# EAGLE design HalfA (EAGLE 9.5.1)
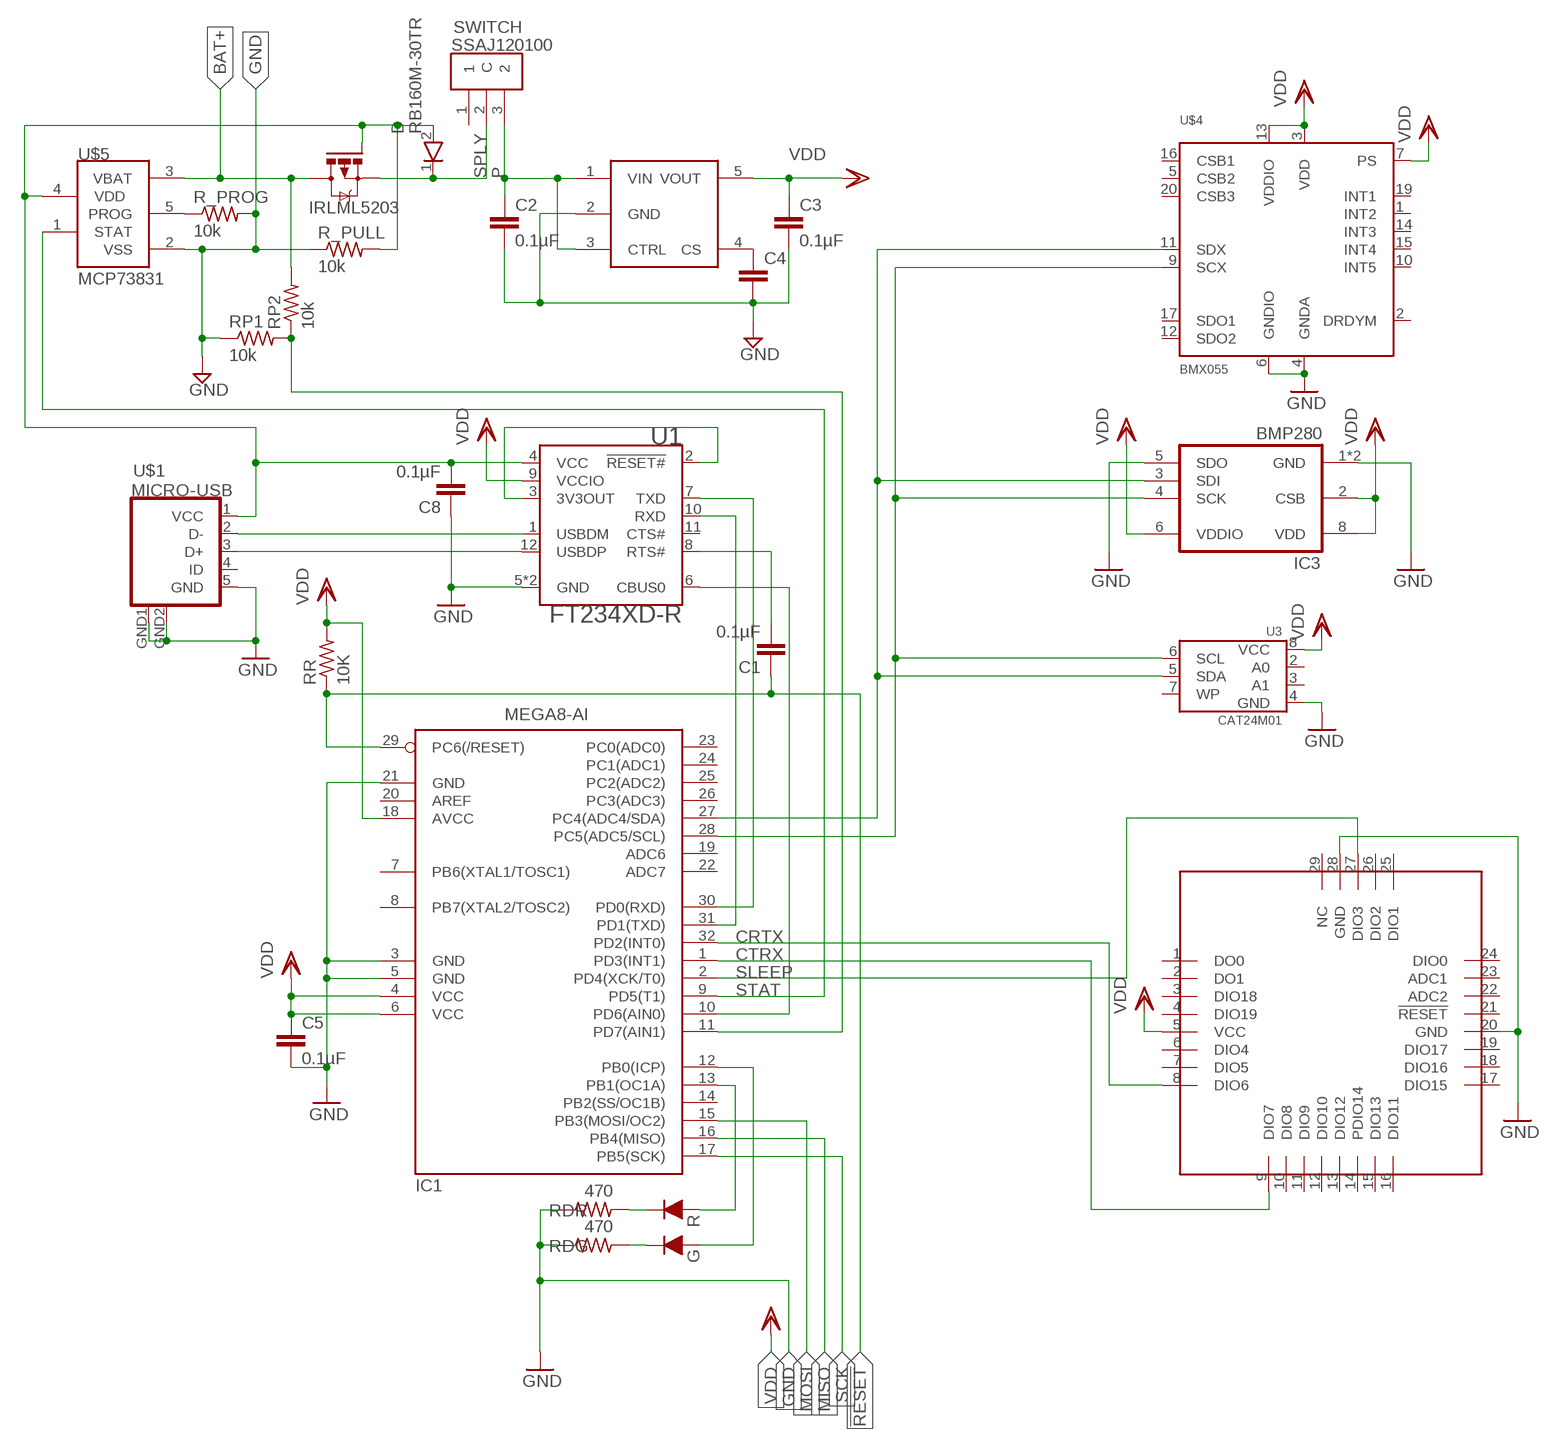
[diagram p0: schematic, sheet 1]

## Parts
C1  0.1µF  C-EUC0402K  [C0402K]
C2  0.1µF  C-EUC0402K  [C0402K]
C3  0.1µF  C-EUC0402K  [C0402K]
C4  C-EUC0402K  [C0402K]
C5  0.1µF  C-EUC0402K  [C0402K]
C8  0.1µF  C-EUC0402K  [C0402K]
D  RB160M-30TR  [SODFL3516X90N]
IC1  MEGA8-AI  [TQFP32-08]
IC3  BMP280  [BMP280]
Q1  IRLML5203  [MICRO3]
R_PROG  10k  R-US_R0402  [R0402]
R_PULL  10k  R-US_R0402  [R0402]
RDG  470  R-US_R0402  [R0402]
RDR  470  R-US_R0402  [R0402]
RP1  10k  R-US_R0402  [R0402]
RP2  10k  R-US_R0402  [R0402]
RR  10K  R-US_R0402  [R0402]
SWITCH  SSAJ120100  [SSAJ120100]
U1  FT234XD-R  [SON45P300X300X80-13N]
U3  CAT24M01  [SO-8]
U$1  MICRO-USB  [MICRO-USB]
U$2  NJM12888F  [NJM12888F]
U$3  LITE  [LITE]
U$4  BMX055  [BMX055]
U$5  MCP73831  [SOT23-5L]
U$6  SML-P24MUW  [SML-P24MUW]

## Nets
3.3V: U1.2(!RESET#) U1.3(3V3OUT)
5V: C8.2 D.2(A) Q1.1(G) R_PULL.2 U1.4(VCC) U$1.1(VCC) U$5.4(VDD)
!RESET!: C1.1 IC1.29(PC6(/RESET)) RR.1
!RTS!: C1.2 U1.8(RTS#)
BAT: IC1.11(PD7(AIN1)) RP1.2 RP2.1
BAT+: Q1.3(D) RP2.2 U$5.3(VBAT)
CRTX: IC1.32(PD2(INT0)) U$3.8(DIO6)
CS: C4.1 U$2.4(CS)
CTRX: IC1.1(PD3(INT1)) U$3.9(DIO7)
D+: U1.12(USBDP) U$1.3(D+)
D-: U1.1(USBDM) U$1.2(D-)
GND: C2.2 C3.2 C4.2 C5.2 C8.1 IC1.3(GND) IC1.5(GND) IC1.21(GND) IC3.1(GND) IC3.5(SDO) IC3.7(GND) R_PROG.2 R_PULL.1 RDG.1 RDR.1 RP1.1 U1.5(GND) U1.13(GND) U3.4(GND) U$1.5(GND) U$1.GND1(GND) U$1.GND2(GND) U$2.2(GND) U$3.20(GND) U$3.28(GND) U$4.4(GNDA) U$4.6(GNDIO) U$5.2(VSS)
LED: IC1.13(PB1(OC1A)) U$6.2(RA)
LEDG: IC1.12(PB0(ICP)) U$6.1(GA)
MISO: IC1.16(PB4(MISO))
MOSI: IC1.15(PB3(MOSI/OC2))
N$2: RDR.2 U$6.3(RC)
N$4: RDG.2 U$6.4(GC)
N$9: R_PROG.1 U$5.5(PROG)
P: C2.1 SWITCH.3 U$2.1(VIN) U$2.3(CTRL)
SCK: IC1.17(PB5(SCK))
SCL: IC1.28(PC5(ADC5/SCL)) IC3.4(SCK) U3.6(SCL) U$4.9(SCX)
SDA: IC1.27(PC4(ADC4/SDA)) IC3.3(SDI) U3.5(SDA) U$4.11(SDX)
SLEEP: IC1.2(PD4(XCK/T0)) U$3.27(DIO3)
SPLY: D.1(K) Q1.2(S) SWITCH.2(C)
STAT: IC1.9(PD5(T1)) U$5.1(STAT)
TX/RX: IC1.10(PD6(AIN0)) U1.6(CBUS0)
URTX: IC1.30(PD0(RXD)) U1.7(TXD)
UTRX: IC1.31(PD1(TXD)) U1.10(RXD)
VDD: C3.1 C5.1 IC1.4(VCC) IC1.6(VCC) IC1.18(AVCC) IC3.2(CSB) IC3.6(VDDIO) IC3.8(VDD) RR.2 U1.9(VCCIO) U3.8(VCC) U$2.5(VOUT) U$3.5(VCC) U$4.3(VDD) U$4.7(PS) U$4.13(VDDIO)
Unconnected: IC1.7(PB6(XTAL1/TOSC1)) IC1.8(PB7(XTAL2/TOSC2)) IC1.14(PB2(SS/OC1B)) IC1.19(ADC6) IC1.20(AREF) IC1.22(ADC7) IC1.23(PC0(ADC0)) IC1.24(PC1(ADC1)) IC1.25(PC2(ADC2)) IC1.26(PC3(ADC3)) SWITCH.1 U1.11(CTS#) U3.2(A0) U3.3(A1) U3.7(WP) U$1.4(ID) U$3.1(DO0) U$3.2(DO1) U$3.3(DIO18) U$3.4(DIO19) U$3.6(DIO4) U$3.7(DIO5) U$3.10(DIO8) U$3.11(DIO9) U$3.12(DIO10) U$3.13(DIO12) U$3.14(PDIO14) U$3.15(DIO13) U$3.16(DIO11) U$3.17(DIO15) U$3.18(DIO16) U$3.19(DIO17) U$3.21(!RESET!) U$3.22(ADC2) U$3.23(ADC1) U$3.24(DIO0) U$3.25(DIO1) U$3.26(DIO2) U$3.29(NC) U$4.1(INT2) U$4.2(DRDYM) U$4.5(CSB2) U$4.10(INT5) U$4.12(SDO2) U$4.14(INT3) U$4.15(INT4) U$4.16(CSB1) U$4.17(SDO1) U$4.19(INT1) U$4.20(CSB3)

## Library data of the parts
C1-C5 C8 = rcl:C-EU: CAPACITOR, European symbol; SPICEPREFIX: C
D = RB160M-30TR:RB160M-30TR: ROHM - RB160M-30TR - DIODE, SCHOTTKY, PMDS Source: Datasheet <https://componentsearchengine.com/Datasheets/2/RB160M-30TR.pdf>; DESCRIPTION: ROHM - RB160M-30TR - DIODE, SCHOTTKY, PMDS; HEIGHT: 0.9mm; MANUFACTURER_NAME: ROHM Semiconductor; MANUFACTURER_PART_NUMBER: RB160M-30TR; MOUSER_PART_NUMBER: 755-RB160M-30TR; MOUSER_PRICE-STOCK: https://www.mouser.com/Search/Refine.aspx?Keyword=755-RB160M-30TR; RS_PART_NUMBER: 7526079; RS_PRICE-STOCK: https://uk.rs-online.com/web/p/products/7526079
IC1 = atmel:MEGA8: MICROCONTROLLER 8 Kbytes FLASH, 1 kbytes SRAM, 512 bytes EEPROM, USART, 6-channel 10 bit ADC, 2-channel 8 bit ADC Pin compatible with Atmega48, ATMega88, ATMega168 Source: avr.lbr; MPN: ATMEGA8-16AU; OC_FARNELL: 9171371; OC_NEWARK: 73M8863
IC3 = bosch-bmp280:BMP280: The BMP280 is an absolute barometric pressure sensor especially designed for mobile applications. The sensor module is housed in an extremely compact 8-pin metal-lid LGA package with a footprint of only 2.0 × 2.5 mm2 and 0.95 mm package height. Its small dimensions and its low power consumption of 2.7 μA @1Hz allow the implementation in battery driven devices such as mobile phones, GPS modules or watches. The library has been designed by Richard Magdycz <https://www.facebook.com/groups/eaglecadsoftUK>
Q1 = transistor-power:IRLML5203: HEXFET P-Channel Power MOSFET
R_PROG R_PULL RDG RDR RP1 RP2 RR = rcl:R-US_: RESISTOR, American symbol; SPICEPREFIX: R
SWITCH = SSAJ120100:SSAJ120100: Slide Switches 1-pole 2-positions Surface Mount Slide Switch SPDT Maintained 10 mA Slide Source: Datasheet <http://www.farnell.com/datasheets/1582290.pdf>; DESCRIPTION: Slide Switches 1-pole 2-positions Surface Mount Slide Switch SPDT Maintained 10 mA Slide; HEIGHT: mm; MANUFACTURER_NAME: ALPS; MANUFACTURER_PART_NUMBER: SSAJ120100; MOUSER_PART_NUMBER: 688-SSAJ120100; MOUSER_PRICE-STOCK: https://www.mouser.com/Search/Refine.aspx?Keyword=688-SSAJ120100; RS_PART_NUMBER: 1238892; RS_PRICE-STOCK: http://uk.rs-online.com/web/p/products/1238892
U1 = FT234XD-R:FT234XD-R: USB Full Speed to Basic UART IC with USB Charger Detection; DESCRIPTION: USB Full Speed to Basic UART IC with USB Charger Detection; DIGI-KEY_PART_NUMBER: 768-1178-1-ND; DIGI-KEY_PURCHASE_URL: https://www.digikey.jp/product-detail/en/ftdi-future-technology-devices-international-ltd/FT234XD-R/768-1178-1-ND/3904926?utm_source=snapeda&utm_medium=aggregator&utm_campaign=symbol; MF: FTDI,; MP: FT234XD-R; PACKAGE: DFN-12 FTDI
U3 = CAT24M01:CAT24M01: 1Mb I2C CMOS EEPROM; AVAILABILITY: Unavailable; DESCRIPTION: ON Semiconductor 1MB I2C SERIAL EEPROM; MF: ON Semiconductor; MP: CAT24M01; PACKAGE: SOIC-8 ON Semiconductor; PRICE: None
U$1 = microusb2:MICRO-USB: Micro USB B connector
U$2 = mylib:NJM12888F
U$3 = TWELite:LITE
U$4 = BMX055:BMX055: BMX055 Small, versatile 9 - axis sensor module; DIGI-KEY_PART_NUMBER: 828-1060-1-ND; DIGI-KEY_PURCHASE_URL: https://www.digikey.jp/product-detail/en/bosch-sensortec/BMX055/828-1060-1-ND/6136311?utm_source=snapeda&utm_medium=aggregator&utm_campaign=symbol; MF: Bosch Sensortec; MP: BMX055; PACKAGE: LGA-20 Bosch
U$5 = mcp73831:MCP73831: Miniature Single-Cell, Fully Integrated Li-Ion, Li-Polymer Charge Management Controllers
U$6 = mylib:SML-P24MUW

## Board
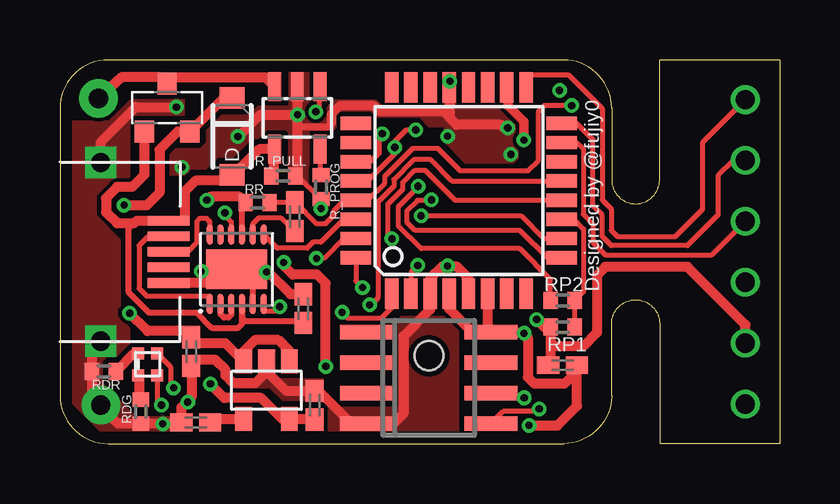
[diagram p1: board, top side]
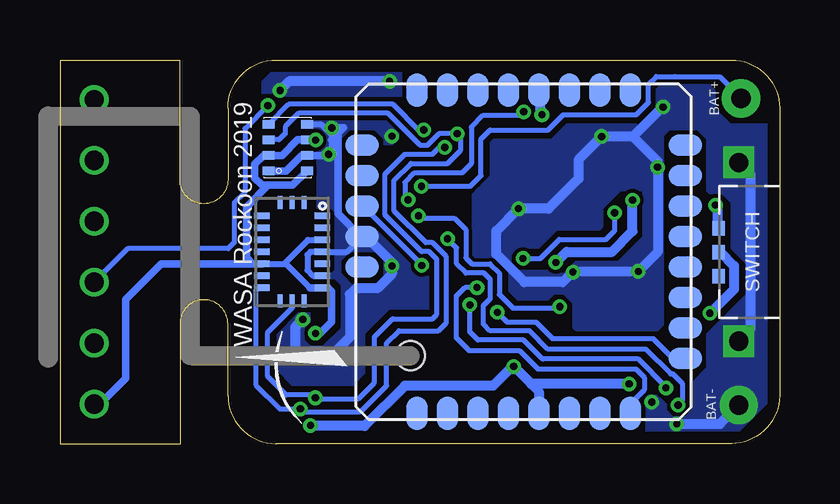
[diagram p2: board, bottom side, seen from below]

Size 30 x 16 mm. Coordinates in mm from the lower left corner, seen from the top.
Outline: 2,0 21,0 arc90 23,2 23,5 arc-180 25,5 25,0 30,0 30,16 25,16 25,11 arc-180 23,11 23,14 arc90 21,16 2,16 arc90 0,14 0,2 arc90 2,0
Copper layers (1*16): Top 0.035mm / dielectric 1.5mm / Bottom 0.035mm
Design rules "SeeedStudio_2layer_DRU_no_angle_20140221 *": minimum track width 6mil, minimum drill 0.3mm, track to track 6mil, track to pad 6mil, pad to pad 6mil, via to via 6mil, smd to smd 0mil, copper to edge 10mil, drill to drill 10mil, minimum pad ring 10mil, minimum via ring 6mil, stop-mask expansion 2mil, vias tented up to drill 100mil, thermal gap 10mil

### Footprints (pad centres in the part's own frame; a part is rotated, then mirrored left to right if it is on the bottom)
C0402K = smd 0.925 x 0.74: 1 -0.6,0; 2 0.6,0
SODFL3516X90N = smd 0.9 x 1.04: 1 -1.6,0; 2 1.6,0
TQFP32-08 = smd 1.27 x 0.559: 1 -4.293,2.8; 2 -4.293,2; 3 -4.293,1.2; 4 -4.293,0.4; 5 -4.293,-0.4; 6 -4.293,-1.2; 7 -4.293,-2; 8 -4.293,-2.8; 17 4.293,-2.8; 18 4.293,-2; 19 4.293,-1.2; 20 4.293,-0.4; 21 4.293,0.4; 22 4.293,1.2; 23 4.293,2; 24 4.293,2.8 | smd 0.559 x 1.27: 9 -2.8,-4.293; 10 -2,-4.293; 11 -1.2,-4.293; 12 -0.4,-4.293; 13 0.4,-4.293; 14 1.2,-4.293; 15 2,-4.293; 16 2.8,-4.293; 25 2.8,4.293; 26 2,4.293; 27 1.2,4.293; 28 0.4,4.293; 29 -0.4,4.293; 30 -1.2,4.293; 31 -2,4.293; 32 -2.8,4.293
BMP280 = smd 0.35 x 0.5: 1 0.975,-0.8; 2 0.325,-0.8; 3 -0.325,-0.8; 4 -0.975,-0.8; 5 -0.975,0.8; 6 -0.325,0.8; 7 0.325,0.8; 8 0.975,0.8
MICRO3 = smd 0.8 x 0.9: 1 -0.95,-1; 2 0.95,-1; 3 0,1
R0402 = smd 0.6 x 0.7: 1 -0.5,0; 2 0.5,0
SSAJ120100 = smd 0.6 x 0.51: 1 0,0; 2 2,0; 3 1,0
SON45P300X300X80-13N = smd 0.85 x 0.25: 1 -1.45,1.125; 2 -1.45,0.675; 3 -1.45,0.225; 4 -1.45,-0.225; 5 -1.45,-0.675; 6 -1.45,-1.125; 7 1.45,-1.125; 8 1.45,-0.675; 9 1.45,-0.225; 10 1.45,0.225; 11 1.45,0.675; 12 1.45,1.125 | smd 1.65 x 2.55: 13 0,0
SO-8 = smd 2.2 x 0.6: 1 -2.6,1.905; 2 -2.6,0.635; 3 -2.6,-0.635; 4 -2.6,-1.905; 5 2.6,-1.905; 6 2.6,-0.635; 7 2.6,0.635; 8 2.6,1.905
MICRO-USB = smd 0.4 x 1.75: 1 -1.3,4.525; 2 -0.65,4.525; 3 0,4.525; 4 0.65,4.525; 5 1.3,4.525 | drill 0.8 pad 1.27 square: GND1 -3.725,1.7; GND2 3.725,1.7
NJM12888F = smd 0.7 x 1: 1 -0.95,-1.2; 2 0,-1.2; 3 0.95,-1.2; 4 0.95,1.2; 5 -0.95,1.2
LITE = smd 1.4 x 0.9: 1 0.25,11.43; 2 0.25,10.16; 3 0.25,8.89; 4 0.25,7.62; 5 0.25,6.35; 6 0.25,5.08; 7 0.25,3.81; 8 0.25,2.54; 17 13.72,2.54; 18 13.72,3.81; 19 13.72,5.08; 20 13.72,6.35; 21 13.72,7.62; 22 13.72,8.89; 23 13.72,10.16; 24 13.72,11.43 | smd 0.9 x 1.4: 9 2.54,0.25; 10 3.81,0.25; 11 5.08,0.25; 12 6.35,0.25; 13 7.62,0.25; 14 8.89,0.25; 15 10.16,0.25; 16 11.43,0.25; 25 11.43,13.72; 26 10.16,13.72; 27 8.89,13.72; 28 7.62,13.72; 29 6.35,13.72 | hole 1.2: 2.65,11.7
BMX055 = smd 0.675 x 0.25: 1 1.262,1.5; 2 1.262,1; 3 1.262,0.5; 4 1.262,0; 5 1.262,-0.5; 6 1.262,-1; 7 1.262,-1.5; 11 -1.262,-1.5; 12 -1.262,-1; 13 -1.262,-0.5; 14 -1.262,0; 15 -1.262,0.5; 16 -1.262,1; 17 -1.262,1.5 | smd 0.25 x 0.55: 8 0.5,-2.05; 9 0,-2.05; 10 -0.5,-2.05; 18 -0.5,2.05; 19 0,2.05; 20 0.5,2.05
SOT23-5L = smd 0.533 x 1.2: 1 -0.95,-1.3; 2 0,-1.3; 3 0.95,-1.3 | smd 0.55 x 1.2: 4 0.95,1.3; 5 -0.95,1.3
SML-P24MUW = smd 0.5 x 0.5: 1 -0.45,-0.4; 2 0.45,-0.4; 3 0.45,0.4; 4 -0.45,0.4

### Placement (x,y rotation side)
C1  9.79,9.46 270 top
C2  5.47,3.84 270 top
C3  10.62,1.6 90 top
C4  5.67,0.88 180 top
C5  20.95,3.27 180 top
C8  10.15,5.63 270 top
D  7.17,12.81 270 top
IC1  16.63,10.55 90 top
IC3  20.5,12.34 270 bottom
Q1  4.47,14.01 0 top
R_PROG  10.88,10.7 270 top
R_PULL  9.3,11.16 180 top
RDG  3.37,1.34 90 top
RDR  1.83,3.01 0 top
RP1  20.95,4.86 0 top
RP2  20.95,5.97 180 top
RR  8.24,10.05 180 top
SWITCH  2.54,6.98 90 bottom
U1  7.37,7.27 90 top
U3  15.37,2.74 0 top
U$1  0,8 270 top
U$2  8.61,2.23 180 top
U$3  3.68,1.01 90 bottom
U$4  20.32,8 0 bottom
U$5  9.9,13.58 180 top
U$6  3.65,3.3 90 top

### Tracks (layer width: path | path; a pad name or v marks a point on that pad's centre or on a via)
3.3V
  Top 0.254: U1.3 7.14,5.38 7.02,5.26 6.84,5.26 6.69,5.4 U1.2
5V
  Top 0.254: 3.09,9.19 2.87,8.96 2.87,6.3 3.71,5.46 5.69,5.46 6.33,4.83 7.43,4.83 7.59,4.99 U1.4 7.59,5.23 7.73,5.1 10.08,5.1 C8.2
  Top 0.406: R_PULL.2 8.9,11.25 8.9,12.23 U$5.4 8.31,12.28 7.25,11.21 D.2 6.92,10.97 5.65,10.97 5.19,10.51 5.19,9.3 U$1.1 3.21,9.3 3.09,9.19 2.38,9.19 1.92,9.64 1.92,10.24 2.38,10.7 3.02,10.7 3.52,11.2 Q1.1
!RESET!  (via drill 0.3, 0.8)
  Top 0.2: v21.34,14.1 20.19,14.1 19.94,13.84 19.94,11.81 19.51,11.38 16.68,11.38 15.75,12.32 14.71,12.32 13.54,11.15 13.54,10.87 12.83,10.15 IC1.29 11.87,10.15 11.43,9.72 11.43,9.53 11.08,9.17 10.69,9.17 C1.1 9.78,10.05 RR.1
  Bottom 0.2: v21.34,14.1 22.29,13.14 22.29,10.47 22.73,10.03 22.73,8.38 22.99,8.13 27.18,8.13 v28.57,6.73
!RTS!
  Top 0.2: U1.8 8.04,9.16 8.3,9.42 9.19,9.42 9.74,8.87 C1.2
BAT
  Top 0.2: IC1.11 20.95,9.38 21.4,9.38 21.83,8.95 21.83,6.34 RP2.1 RP1.2
BAT+  (via drill 0.3, 0.8 pad 1.6)
  Top 0.2: RP2.2 20.45,6.85 19.18,8.13 15.06,8.13 14.1,9.08 14.1,9.87 14.93,10.7 v14.93,10.73
  Top 0.406: v1.6,14.4 2.56,15.28 4.2,15.28 Q1.3 4.73,15.27 8.56,15.27 U$5.3
  Bottom 0.2: v1.6,14.4 2.49,15.29 4.38,15.3 5.14,15.3 5.46,14.98 5.46,14.22 5.97,13.71 9.02,13.71 9.65,13.08 12.06,13.08 12.45,12.7 12.45,11.18 12.89,10.73 v14.93,10.73
CRTX  (via drill 0.3)
  Top 0.2: IC1.32 12.34,6.79 v12.62,6.51
  Bottom 0.2: v12.62,6.51 13.11,6.51 13.48,6.14 13.48,4.42 12.94,3.88 10.85,3.88 10.08,3.11 5.99,3.11 5.64,2.76 5.64,2.23 6.22,1.65 U$3.8
CS
  Top 0.406: C4.1 6.41,1.03 U$2.4
CTRX  (via drill 0.3)
  Top 0.2: v11.76,5.47 12.02,5.22 13.39,5.22 13.83,5.66 IC1.1
  Bottom 0.2: U$3.9 4.44,3.56 5.26,4.37 9.46,4.37 10.15,5.07 11.36,5.07 v11.76,5.47
D+
  Top 0.2: U$1.3 5.33,8 5.71,8.38 5.71,9.27 5.84,9.4 6.1,9.4 6.24,9.25 U1.12
D-
  Top 0.2: U$1.2 4.51,8.63 3.68,8.63 3.3,8.25 3.3,6.48 3.64,6.14 6.18,6.14 6.24,6.07 U1.1
GND  (via drill 0.3, 0.8, 0.8 pad 1.6)
  Top 0.2: R_PROG.2 10.86,10.2 9.89,11.16 R_PULL.1
  Top 0.254: U1.5 8.03,5.83 8.03,6.61 U1.13
  Top 0.3: 11.32,13.38 11.14,13.21 9.91,13.21
  Top 0.4: 16.24,13.59 15.99,13.84 13.34,13.84 13.08,14.1 11.67,14.1 11.32,13.74 11.32,13.38
  Top 0.406: v18.66,13.17 18.5,13.17 18.37,13.3 16.53,13.3 16.24,13.59 IC1.21 16.23,15.09 v16.26,15.11 | v7.42,12.8 7.44,12.8 8.35,13.71 v9.91,13.71 | U$1.GND2 1.33,3.91 RDR.1 1.33,1.92 v1.7,1.6 2.33,0.92 2.42,0.83 RDG.1 5.02,0.83 C4.2 5.07,1.51 5.48,1.93 5.48,3.23 C2.2 5.72,3.49 6.5,3.49 6.9,3.09 6.9,2.83 7.22,2.51 8.13,2.51 8.61,3 U$2.2 8.61,3.02 9.43,2.2 C3.2 10.77,2.2 12.14,0.83 U3.4 12.85,0.76 13.84,0.76 14.32,1.24 14.32,4.47 15.43,5.58 IC1.3 15.43,6.9 15.91,7.38 16.13,7.38 v16.16,7.41 16.18,7.38 16.56,7.38 17.03,6.91 IC1.5 | U$1.5 6.8,6.7 U1.13 8.33,7.27 8.44,7.15 v8.61,7.15 8.69,7.15 9.61,6.23 C8.1 | 20.45,4.06 RP1.1 20.19,4.86 v19.87,5.17 | 20.45,4.06 20.45,3.37 C5.2 | U$5.2 9.91,14.86 v9.91,13.71 | R_PULL.1 9.91,11.26 9.91,13.21 v9.91,13.71 | 20.45,4.06 21.82,4.06 22.39,4.63 22.39,7.02 22.73,7.37 26.16,7.37 28.57,4.95 v28.57,4.19 | U$1.GND1 1.7,12.57 3.17,14.03 v4.86,14.03 | R_PROG.2 v10.88,9.8
  Bottom 0.254: U$3.28 18.04,8 U$4.4 19.56,8 19.68,7.87 19.68,7.24 19.45,7 U$4.6 | IC3.5 19.12,13.32 18.68,12.88 18.68,12.66 18.68,12.15
  Bottom 0.305: 18.68,12.15 18.81,12.02 IC3.7 19.92,12.02 20.57,11.37 IC3.1 | 18.68,12.66 18.17,13.17 v18.66,13.17 18.41,12.92 18.41,9.58 17.47,8.63 U$3.28
  Bottom 0.4: v5.89,7.18 8.58,7.18 v8.61,7.15
  Bottom 0.406: U$1.GND1 1.23,11.25 1.23,4.75 U$1.GND2 | U$3.28 17.24,8.63 16.16,7.55 v16.16,7.41 16.16,7.08 16.76,6.48 17.65,6.48 17.91,6.22 17.91,4.44 18.67,3.68 19.94,3.68 20.19,3.94 20.19,4.85 v19.87,5.17 | U$3.20 10.09,14.73 9.97,14.61 9.97,13.71 v9.91,13.71 | 6.12,12.8 v7.42,12.8 8.38,11.84 8.38,11.05 9.63,9.8 v10.88,9.8 11.81,8.87 11.81,7.9 10.64,6.73 9.03,6.73 v8.61,7.15 | 6.12,12.8 5.08,11.77 v5.08,11.53 5.08,7.99 v5.89,7.18 | v4.86,14.03 4.89,14.03 6.12,12.8 | v4.28,0.82 2.48,0.82 v1.7,1.6 | v16.26,15.11 20.45,15.11 v20.83,14.73
  other vias: 5.32,1.73 16.16,12.82 18.8,12.06
  pour Top: 16,5.33 14.22,5.33 14.1,5.21 14.1,0.51 16.64,0.51 16.64,4.7
  pour Top (no thermals): 0.51,13.46 2.92,13.46 2.92,11.05 2.29,11.05 2.03,10.79 0.51,10.79
  pour Top (no thermals): 11.18,1.65 11.18,0.51 14.22,0.51 14.22,1.4 14.1,1.52 11.68,1.52 11.56,1.65
  pour Top (no thermals): 10.67,1.78 9.27,1.78 8.75,2.3 7.34,2.3 7.34,2.64 7.43,2.73 10.98,2.73 10.98,2.09
  pour Top (no thermals): 5.46,0.51 1.65,0.51 0.51,1.65 0.51,11.43 0.64,11.3 2.29,11.3 1.98,11 1.98,10.8 1.52,10.34 1.52,9.52 1.52,5.71 1.78,5.46 1.78,2.54 1.91,2.41 3.17,1.14 5.08,1.14 5.46,0.76
  pour Top (no thermals): 1.78,3.43 1.97,3.62 2.36,3.62 2.92,4.18 2.92,4.44 2.92,4.83 2.41,5.33 2.41,5.59 2.54,5.71 2.54,8.25 2.54,8.51 1.52,9.52 1.52,3.68
  pour Top (no thermals): 2.93,13.22 2.93,13.6 3,13.67 5.21,13.67 5.21,14.38 2.95,14.38 1.91,13.33 1.91,13.08 2.03,13.21 2.92,13.21
  pour Top (no thermals): 10.41,10.67 10.41,15.49 9.53,15.49 9.53,14.1 8.26,14.1 7.87,13.71 7.37,13.71 6.73,13.71 6.1,13.08 6.1,12.83 6.1,12.57 5.84,12.32 4.83,12.32 4.57,12.06 4.57,11.18 5.21,11.18 5.46,11.43 6.1,11.43 6.6,11.94 6.73,11.94 7.24,11.94 8,12.7 8.26,12.7 8.64,13.08 9.4,13.08 9.51,12.96 9.51,11.28 9.8,11.28
  pour Top (no thermals): 16,14.48 16,12.57 16.89,11.68 18.9,11.68 19.11,11.9 19.11,13.97 16.51,13.97 16.51,14.6 16.38,14.48
  pour Bottom (no thermals): 19.56,5.46 20.07,5.46 20.95,4.57 20.95,3.05 20.32,2.41 17.78,2.41 17.27,2.92 17.27,4.57 16.26,5.59 14.61,5.59 14.61,6.98 15.11,6.98 15.37,7.24 15.37,7.49 16.89,9.02 17.78,9.02 18.03,8.76 18.03,7.87 17.91,8 16.51,8 16.51,6.98 16.89,6.6 18.29,6.6 18.29,4.83 19.05,4.06 19.56,4.06 19.81,4.32 19.81,4.83 19.56,5.08
  pour Bottom (no thermals): 10.16,10.67 12.57,10.67 12.83,10.41 12.83,7.87 12.7,7.75 11.56,7.75 11.3,7.49 11.18,7.49 11.18,7.87 10.92,8.13 10.03,8.13 9.27,8.89 7.49,8.89 7.37,9.02 7.37,9.78 5.33,11.81 5.33,12.7 5.97,13.33 8.89,13.33 9.4,12.83 9.4,11.43
  pour Bottom (no thermals): 11.3,7.24 11.3,6.35 10.92,5.97 9.65,5.97 9.53,6.09 9.4,6.22 9.02,6.22 8.64,5.84 8.64,4.83 8.51,4.7 5.08,4.7 4.95,4.83 4.83,4.95 4.83,11.81 5.59,11.81 5.71,11.68 5.71,8.63 6.73,7.62 8.51,7.62 8.89,7.24 9.02,7.11 9.53,7.11 9.65,7.24
  pour Bottom (no thermals): 5.16,13.76 5.16,14.78 4.95,14.98 2.92,14.98 2.67,14.73 2.67,13.97 2.03,13.33 0.51,13.33 0.51,11.05 2.92,11.05 3.05,11.18 3.05,12.7 3.43,13.08 4.57,13.08 4.83,12.83 4.83,10.67 4.95,10.54 6.86,10.54 6.86,12.06
  pour Bottom (no thermals): 5.59,0.51 1.65,0.51 0.51,1.65 0.51,11.3 3.05,11.3 3.05,10.54 2.92,10.41 2.41,10.41 2.03,10.03 2.03,8.13 1.4,7.49 1.4,6.22 3.05,4.57 3.05,3.17 3.68,2.54 3.68,1.4 3.94,1.14 4.45,1.14 4.7,1.4 4.7,1.65 5.08,2.03 5.59,2.03
  pour Bottom (no thermals): 9.53,12.7 11.94,12.7 12.06,12.57 12.06,11.18 12.83,10.41 12.83,9.52 9.14,9.52 9.14,13.08
  pour Bottom (no thermals): 15.75,15.49 21.21,15.49 21.59,15.11 21.59,14.6 21.08,14.6 20.95,14.48 15.75,14.48
  pour Bottom (no thermals): 19.94,13.46 16.38,13.46 15.88,12.95 15.88,12.7 16.13,12.45 16.51,12.45 16.51,12.7 16.89,13.08 17.91,13.08 18.29,12.7 18.29,9.78 18.54,9.52 18.54,9.65 18.67,9.78 19.3,9.78 19.3,12.95 19.56,13.21 19.68,13.21
  pour Bottom (no thermals): 18.54,9.65 18.54,7.24 18.67,7.11 18.8,7.11 18.8,6.86 18.54,6.86 18.03,6.35 17.53,6.35 17.53,6.48 17.65,6.6 17.78,6.6 18.29,7.11 18.29,7.49 18.29,7.62 17.91,8 17.91,9.02
  pour Top (no thermals): 10.41,13.46 10.92,13.46 11.11,13.65 11.11,14.03 11.43,14.35 13.21,14.35 13.59,13.97 16.13,13.97 16.13,13.21 15.37,13.21 14.99,13.59 13.21,13.59 12.95,13.84 11.68,13.84 11.56,13.71 11.56,13.21 11.4,13.05 10.34,13.05 10.34,13.39
LED  (via drill 0.3)
  Top 0.2: U$6.2 4.61,3.19 4.61,2.45 v4.74,2.32 | v12.91,5.78 12.96,5.78 13.26,6.08 13.26,10.07 13.92,10.73 13.92,11.02 14.75,11.84 15.46,11.84 16.35,10.95 IC1.13
  Bottom 0.2: v4.74,2.32 4.74,2.37 5.89,3.53 9.88,3.53 10.67,4.32 12.57,4.32 12.91,4.66 v12.91,5.78
LEDG  (via drill 0.3)
  Top 0.2: U$6.1 4.05,1.78 v4.23,1.6 | IC1.12 16.48,10.15 15.23,11.4 14.81,11.4 14.3,10.89 14.3,10.61 13.67,9.98 13.67,8.7 v13.83,8.54 v13.84,8.54
  Bottom 0.2: v4.23,1.6 4.03,1.8 4.03,2.49 4.44,2.9 4.54,2.9 5.58,3.94 9.65,3.94 10.41,4.7 12.06,4.7 12.35,4.98 12.35,5.76 12.06,6.05 12.06,6.85 12.32,7.11 13.08,7.11 13.46,7.49 13.46,8.16 v13.84,8.54
MISO  (via drill 0.8)
  Top 0.2: IC1.16 21.56,13.35 22.23,12.68 22.23,9.9 22.61,9.52 22.61,8.63 22.99,8.25 26.16,8.25 27.43,9.52 27.43,11.18 28.07,11.81 v28.57,11.81
MOSI  (via drill 0.8)
  Top 0.2: IC1.15 21.56,12.55 21.81,12.3 21.81,9.55 22.23,9.14 22.23,8.38 22.73,7.87 27.18,7.87 v28.57,9.27
N$2
  Top 0.406: RDR.2 3.08,3.75 U$6.3
N$4
  Top 0.406: U$6.4 3.31,2.8 3.31,1.9 RDG.2
N$9
  Top 0.2: U$5.5 10.85,11.23 R_PROG.1
P  (via drill 0.3)
  Top 0.406: U$2.1 9.56,3.87 9.11,4.32 8.13,4.32 7.66,3.85 U$2.3 6.9,4.18 5.72,4.18 C2.1 5.22,4.69 3.65,4.69 v2.9,5.44
  Bottom 0.406: SWITCH.3 2.48,7.98 1.91,7.41 1.91,6.43 v2.9,5.44
SCK  (via drill 0.8)
  Top 0.2: IC1.17 19.43,15.23 19.56,15.35 21.22,15.35 22.61,13.97 22.61,10.16 22.99,9.78 22.99,8.89 23.24,8.63 25.65,8.63 26.8,9.78 26.8,12.57 v28.57,14.35
SCL  (via drill 0.3)
  Top 0.2: v14.83,13.08 14.43,13.08 13.96,12.61 v13.96,12.36 13.96,12.09 12.83,10.95 IC1.28 | v19.35,1.91 19.33,1.89 18.19,1.89 U3.6
  Bottom 0.2: U$4.9 20.32,5.7 20.3,5.68 21.34,4.64 21.34,2.79 20.57,2.03 19.48,2.03 v19.35,1.91 19.32,1.87 17.56,1.87 16.89,2.54 16.89,4.44 16.13,5.21 14.47,5.21 14.29,5.39 14.29,7.68 14.61,8 14.92,8 16.44,9.52 16.44,11.24 15.62,12.06 14.47,12.06 14.18,12.36 v13.96,12.36 | v14.83,13.08 15.05,13.08 16.11,14.15 20.46,14.15 IC3.4
SDA  (via drill 0.3)
  Top 0.2: IC1.27 12.95,11.75 13.31,12.11 13.31,12.8 v13.44,12.93 | U3.5 18.48,1.34 19.87,1.34 v19.98,1.45
  Bottom 0.2: U$4.11 21.71,6.5 21.84,6.37 21.84,2.45 20.83,1.45 v19.98,1.45 19.86,1.33 17.47,1.33 16.38,2.41 16.38,4.19 15.88,4.7 14.22,4.7 13.89,5.03 13.89,7.79 14.47,8.38 14.74,8.38 16.07,9.7 16.07,10.98 15.37,11.68 13.84,11.68 13.31,12.22 13.31,12.8 v13.44,12.93 14.2,12.93 14.68,12.45 14.99,12.45 16.32,13.78 20.05,13.78 20.61,13.22 20.61,12.92 20.87,12.67 IC3.3
SLEEP  (via drill 0.3)
  Top 0.2: IC1.2 14.64,7.15 v14.91,7.43
  Bottom 0.2: U$3.27 17.37,9.9 14.91,7.45 v14.91,7.43
SPLY  (via drill 0.3)
  Top 0.406: D.1 6.82,14.41 Q1.2 4.91,13.01 4.15,12.25 4.15,10.46 3.63,9.95 v2.67,9.95
  Bottom 0.406: v2.67,9.95 2.59,9.86 2.59,9.04 SWITCH.2
STAT  (via drill 0.3)
  Top 0.2: U$5.1 10.81,14.84 10.81,13.98 v10.67,13.84 | IC1.9 20.31,7.75 19.18,8.89 14.81,8.89 14.48,9.22 14.48,9.72 14.9,10.14 15.46,10.14 v15.49,10.17
  Bottom 0.2: v10.67,13.84 10.82,13.69 12.36,13.69 12.85,13.19 12.85,11.67 13.23,11.3 15.21,11.3 15.62,10.89 15.62,10.3 v15.49,10.17
TX/RX  (via drill 0.3)
  Top 0.2: v9.16,5.71 8.96,5.51 8.49,5.51 U1.6 | IC1.10 20.16,8.55 19.21,9.5 v15.05,9.5
  Bottom 0.2: v15.05,9.5 14.95,9.4 13.56,9.4 13.08,8.92 13.08,7.75 12.83,7.49 12.06,7.49 11.68,7.11 11.68,6.22 11.12,5.65 9.21,5.65 v9.16,5.71
URTX
  Top 0.2: IC1.30 11.83,9.35 10.88,8.4 10.56,8.4 10.31,8.15 9.06,8.15 U1.7
UTRX  (via drill 0.3)
  Top 0.2: v6.88,9.62 6.88,9.51 7.14,9.24 U1.10 | IC1.31 11.83,8.55 11,7.72 v10.69,7.72
  Bottom 0.2: v10.69,7.72 9.97,7.72 9.18,8.51 7.24,8.51 6.88,8.87 v6.88,9.62
VDD  (via drill 0.3, 0.8)
  Top 0.254: U1.9 7.59,9.9 RR.2
  Top 0.4: IC1.18 18.67,14.81 18.67,14.1 19.34,13.43 v19.34,12.66
  Top 0.406: IC1.6 17.83,4.79 U3.8 | U3.8 17.2,4.64 16.23,5.61 IC1.4 | v11.08,3.22 11.08,6.7 10.73,7.05 9.71,7.05 9.33,7.43 v9.33,7.56 | v6.27,2.49 6.85,1.9 8.38,1.9 9.26,1.03 U$2.5 9.59,1 C3.1 | U3.8 19.29,4.64 v19.34,4.6 19.51,4.43 19.51,2.76 19.76,2.51 21.05,2.51 21.55,3.02 C5.1 21.55,1.57 20.74,0.76 v19.55,0.76 | v6.13,10.15 6.28,10.3 7.49,10.3 RR.2
  Bottom 0.254: U$4.3 19.66,8.5 20.66,7.5 | 21.96,7.5 U$4.13 20.66,7.5 | 20.66,7.5 20.57,7.5 19.57,6.5
  Bottom 0.3: v19.34,12.66 v19.35,12.67 IC3.6
  Bottom 0.305: v19.34,4.6 19.15,4.6 18.67,5.08 18.67,6.35 18.82,6.5 U$4.7 19.57,6.5 | IC3.8 20.3,10.77 21.31,10.77 | 21.31,10.77 21.57,10.77 21.88,11.08 21.88,11.65 21.51,12.02 IC3.2 20.75,12.02 20.1,12.67 IC3.6 | 21.31,10.77 22.23,9.86 22.23,7.76 21.96,7.5 | U$4.13 25.77,7.5 27.26,6.02 27.26,2.71 28.32,1.65 v28.57,1.65
  Bottom 0.406: v9.33,7.56 8.88,8 6.99,8 6.13,8.86 v6.13,10.15 | v19.55,0.76 19.55,0.73 17.3,0.73 15.62,2.41 11.94,2.41 11.13,3.22 v11.08,3.22 10.35,2.49 | v6.27,2.49 10.35,2.49 | 10.35,2.49 10.03,2.17 U$3.5

### Text on the board
tNames: Designed by @fujiy0
bNames: BAT+ | WASA Rockoon 2019 | BAT-